# Altium schematic sheet 05-Backplane_Connector.SchDoc
size A3
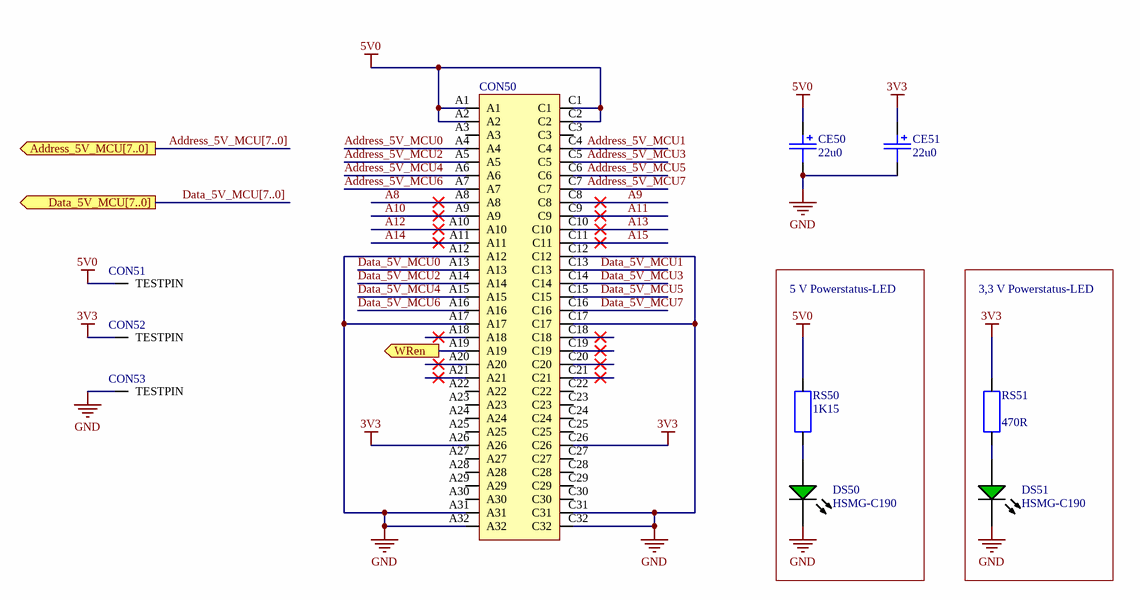
[diagram p0: 05-Backplane_Connector.SchDoc]

## Parts
CE50  22u0  [CE_002_THT_2MM20_S_A]
CE51  22u0  [CE_002_THT_2MM20_S_A]
CON50  103-40034  [CON_064_THT_2MM54_M]  (value not drawn)
CON51  CON_001_M_MM000_S_X_MILL-MAX_TP  [CON_001_THT_MM000_S_D]  (value not drawn)
CON52  CON_001_M_MM000_S_X_MILL-MAX_TP  [CON_001_THT_MM000_S_D]  (value not drawn)
CON53  CON_001_M_MM000_S_X_MILL-MAX_TP  [CON_001_THT_MM000_S_D]  (value not drawn)
DS50  HSMG-C190  [AVAG-HSMX-C190_V]
DS51  HSMG-C190  [AVAG-HSMX-C190_V]
RS50  resistance: 1K15  [0603_A]  (hidden comment: RS)
RS51  resistance: 470R  [0603_A]  (hidden comment: RS)

## Blocks framed on the sheet
5 V Powerstatus-LED: DS50 RS50
3,3 V Powerstatus-LED: DS51 RS51

## Ports
Address_5V_MCU[7..0] (out), Data_5V_MCU[7..0] (out), WRen (out)

## Nets
3V3: CE51.1 CON50.A26 CON50.C26 CON52.1(TESTPIN) RS51.2
5V0: CE50.1 CON50.A1 CON50.A2 CON50.C1 CON50.C2 CON51.1(TESTPIN) RS50.2
GND: CE50.2 CE51.2 CON50.A12 CON50.A17 CON50.A31 CON50.A32 CON50.C12 CON50.C17 CON50.C31 CON50.C32 CON53.1(TESTPIN) DS50.2(K) DS51.2(K)
A8: CON50.A8
A9: CON50.C8
A10: CON50.A9
A11: CON50.C9
A12: CON50.A10
A13: CON50.C10
A14: CON50.A11
A15: CON50.C11
Address_5V_MCU0: CON50.A4
Address_5V_MCU1: CON50.C4
Address_5V_MCU2: CON50.A5
Address_5V_MCU3: CON50.C5
Address_5V_MCU4: CON50.A6
Address_5V_MCU5: CON50.C6
Address_5V_MCU6: CON50.A7
Address_5V_MCU7: CON50.C7
Data_5V_MCU0: CON50.A13
Data_5V_MCU1: CON50.C13
Data_5V_MCU2: CON50.A14
Data_5V_MCU3: CON50.C14
Data_5V_MCU4: CON50.A15
Data_5V_MCU5: CON50.C15
Data_5V_MCU6: CON50.A16
Data_5V_MCU7: CON50.C16
WRen: CON50.A19 ; port WRen
NetDS50_1: DS50.1(A) RS50.1
NetDS51_1: DS51.1(A) RS51.1

Not connected (* = marked no-connect by the designer): CON50 A3 A18* A20* A21* A22 A23 A24 A25 A27 A28 A29 A30 C3 C18* C19* C20* C21* C22 C23 C24 C25 C27 C28 C29 C30

## Buses and harness runs
bus Address_5V_MCU[7..0] =  = port Address_5V_MCU[7..0]
bus Data_5V_MCU[7..0] = port Data_5V_MCU[7..0]

## Notes on the sheet
- Title:
- Date:
- SVN:
- Ver:
- Sheet Size:
- A3
- Sheet Name:
- OF
- Checked By:
- Drawn By:
- Damian Szczypior
- Rev:
- Alle Rechte vorbehalten. Kopien ohne Erlaubnis der X2E GmbH sind nicht gestattet. Dieses Dokument darf ohne die Erlaubnis der X2E GmbH nicht an Dritte (auch nicht in Auszügen) weitergegeben werden .
- Sheet:

## Library data of the parts
CE50 CE51 = CE_RADIAL_22U_50V0_20PO_R07: Teapo Elko TA Series 22µF 50V
CON50 = CON_064_M_2MM54_L_X: C- Male Connector According to IEC 60603-2 (DIN 41612); editor_date: li_08.12.2020
CON51-CON53 = X_00001838: MILL-MAX_TP; ordering_information: digikey, ED90581-ND; entity_type_name: connector; release: blocked; max_operating_temp: 0C; grid: MM000; pin_count_type: X; mounting_type: S; gender: M; number_of_electronic_pins: 001; ordering_information_btm: ED90581-ND; used_in_bom: 1; production_status: Aktiv; editor_date: boos, 06.02.2014; x2e_number: X_00001838; entity_name: CON_001_M_MM000_S_X_MILL-MAX_TP; height: 5mm56; width: 3mm18; length: 3mm18; min_operating_temp: 0C; manufacturer: MILL-MAX; package: THT; shell_material: Tin; series: 2501
DS50 DS51 = CMP-1744-00002-1: Chip LED, Green, 2.2 V, -40 to 85 degC, 2-Pin SMD, RoHS, Tape and Reel; Frequency: 400 KHz; Max Supply Voltage: 5.5 V; Access Time: 3500 ns; Clock Frequency: 100 KHz; Case\Package: SOIC; Density: 32 kb; Nominal Supply Current: 2 mA; Interface: Serial; Min Supply Voltage: 1.7 V; Packaging: Tape and Reel; PackageReference: HSMX-C190; ComponentLink2URL: http://docs.avagotech.com/docs/AV02-0551EN; RoHSCompliant: true; Pins: 8; REACH SVHC: No SVHC; Max Operating Temperature: 85 degC; Width: 4 mm; Radiation Hardening: No; Package Quantity: 3000; ComponentLink3Description: Package Specification; ComponentLink1Description: Manufacturer URL; Min Operating Temperature: -40 degC; PackageDescription: 2-Pin Surface Mount Device, Body 1.6 x 0.8 mm, Height 0.9 mm; Max Clock Frequency: 100 KHz; Height: 1.5 mm; ComponentLink1URL: http://www.avagotech.com/; DatasheetVersion: Mar-12; ComponentLink2Description: Datasheet; Mount: Surface Mount; Length: 5 mm; ComponentLink3URL: http://www.fairchildsemi.com/dwg/MA/MA03D.pdf
RS50 = X_00000390: manufacturer: Yageo; entity_name: RS_0603_1K15_W100_1P00_100PPM; entity_type_name: resistor_standard; power: W100; temp_coefficient: 100PPM; tolerance: 1P00; release: blocked; max_operating_temp: 125C; min_operating_temp: -55C; ordering_information_btm: 541-1.15KHCT-ND; used_in_bom: 1; production_status: Aktiv; x2e_number: X_00000390; series: RC0603; height: mm450; width: mm800; length: 1mm60; package: 0603
RS51 = X_00000061: manufacturer: Yageo; entity_name: RS_0603_470R_W100_1P00_100PPM; entity_type_name: resistor_standard; power: W100; temp_coefficient: 100PPM; tolerance: 1P00; release: blocked; max_operating_temp: 125C; min_operating_temp: -55C; ordering_information_btm: 311-470HRDKR-ND; used_in_bom: 1; production_status: Aktiv; x2e_number: X_00000061; series: RC0603; height: mm450; width: mm800; length: 1mm60; package: 0603